# EAGLE design radio_module_V4.0 (EAGLE 7.3.0)
Assembly variants: X4
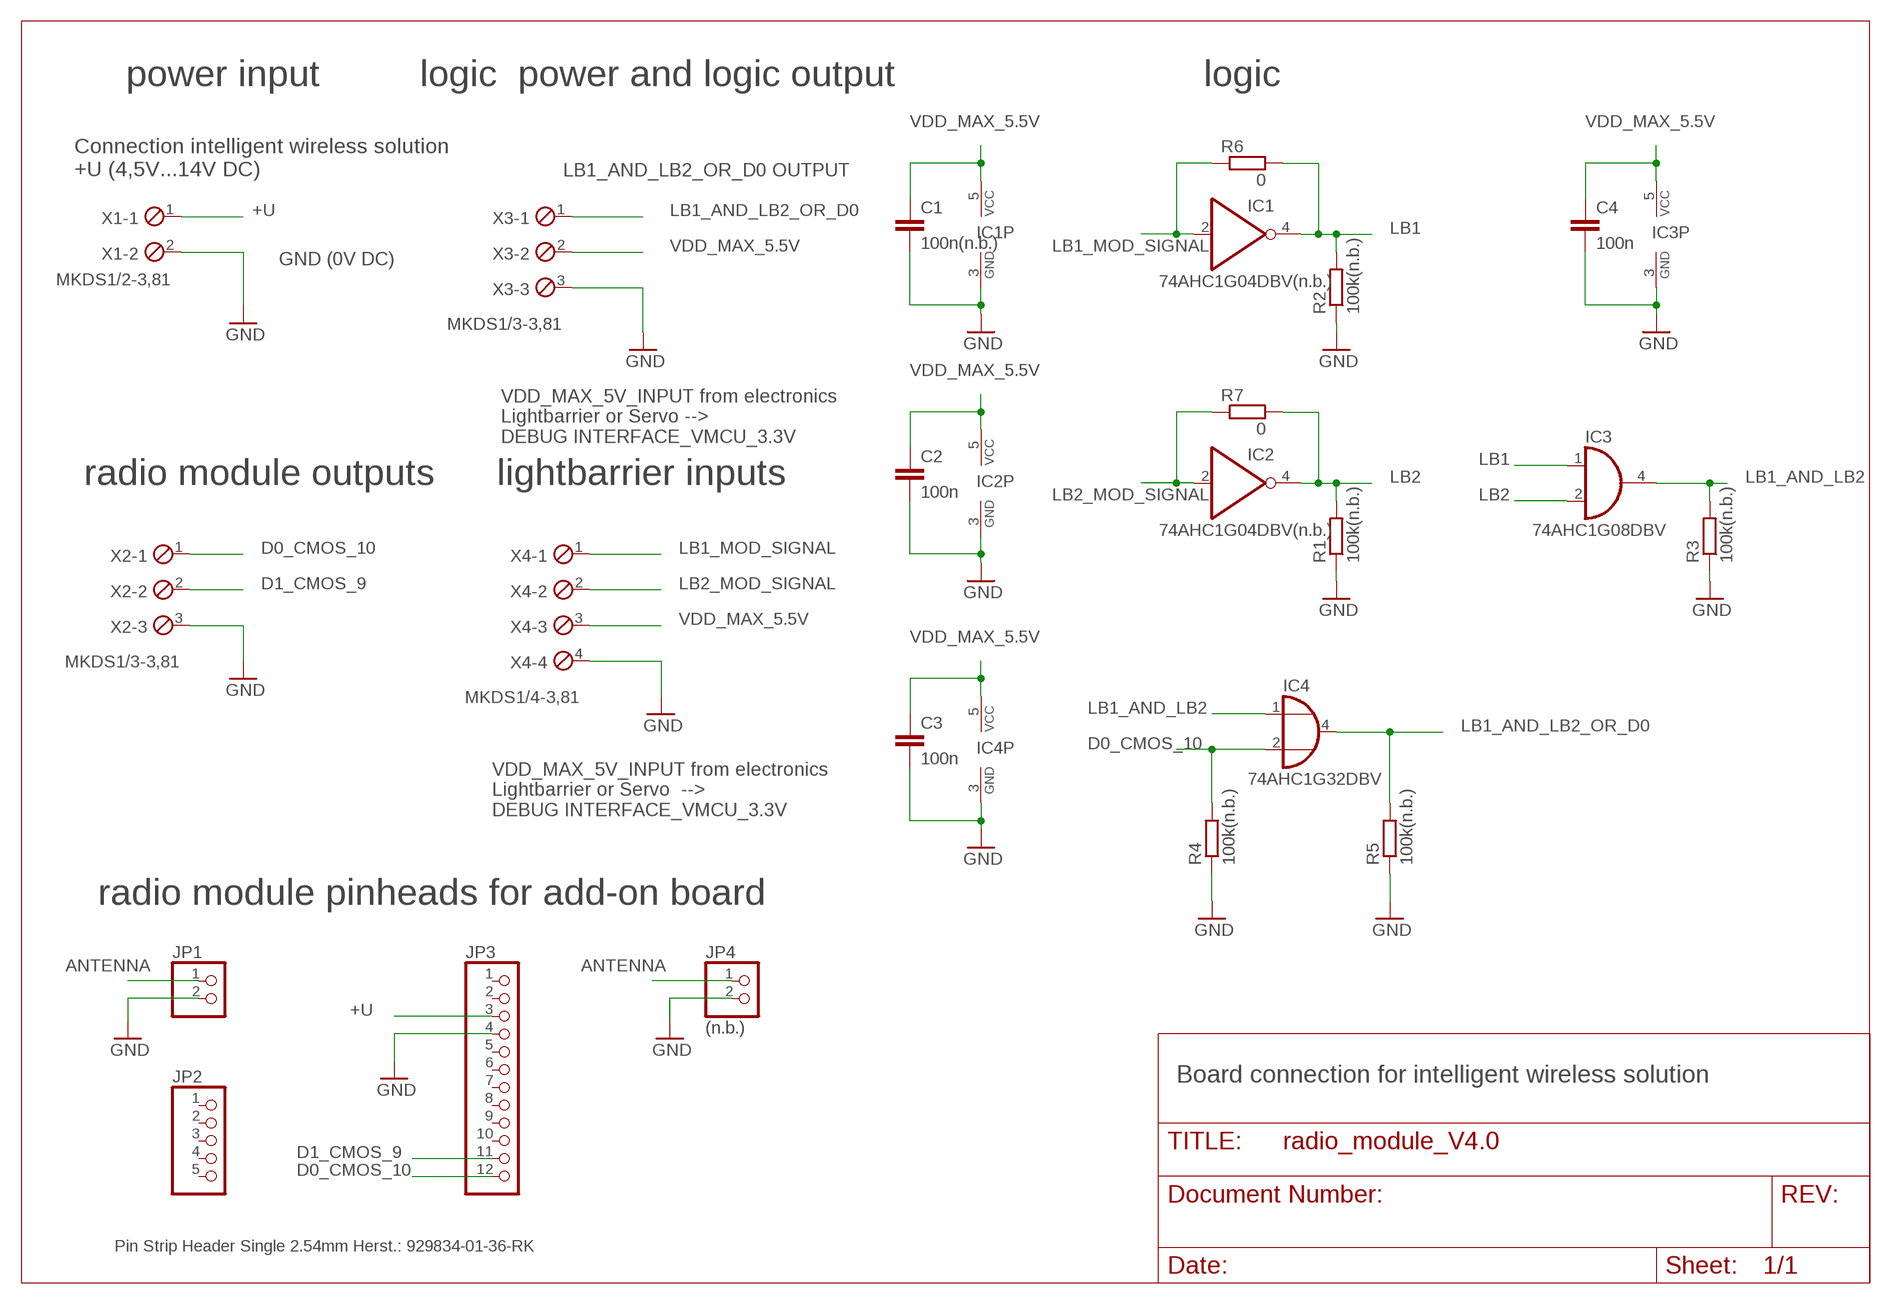
[diagram p0: schematic, sheet 1]

## Parts
C1  100n(n.b.)  C-EUC0805  [C0805]
C2  100n  C-EUC0805  [C0805]
C3  100n  C-EUC0805  [C0805]
C4  100n  C-EUC0805  [C0805]
IC1  74AHC1G04DBV(n.b.)  74AHC1G04DBV  [SOT23-5]
IC2  74AHC1G04DBV(n.b.)  74AHC1G04DBV  [SOT23-5]
IC3  74AHC1G08DBV  [SOT23-5]
IC4  74AHC1G32DBV  [SOT23-5]
JP1  PINHD-1X2  [1X02]
JP2  PINHD-1X5  [1X05]
JP3  PINHD-1X12  [1X12]
JP4  (n.b.)  PINHD-1X2  [1X02]
R1  100k(n.b.)  R-EU_R0805  [R0805]
R2  100k(n.b.)  R-EU_R0805  [R0805]
R3  100k(n.b.)  R-EU_R0805  [R0805]
R4  100k(n.b.)  R-EU_R0805  [R0805]
R5  100k(n.b.)  R-EU_R0805  [R0805]
R6  0  R-EU_R0805  [R0805]
R7  0  R-EU_R0805  [R0805]
X1  MKDS1/2-3,81  [2POL381]
X2  MKDS1/3-3,81  [3POL381]
X3  MKDS1/3-3,81  [3POL381]
X4  MKDS1/4-3,81  [4POL381]

## Nets
+U: JP3.3 X1.1
ANTENNA: JP1.1 JP4.1
D0_CMOS_10: IC4.2(I1) JP3.12 R4.2 X2.1
D1_CMOS_9: JP3.11 X2.2
GND: C1.2 C2.2 C3.2 C4.2 IC1.3(GND) IC2.3(GND) IC3.3(GND) IC4.3(GND) JP1.2 JP3.4 JP4.2 R1.1 R2.1 R3.1 R4.1 R5.1 X1.2 X2.3 X3.3 X4.4
LB1: IC1.4(O) IC3.1(I0) R2.2 R6.2
LB1_AND_LB2: IC3.4(O) IC4.1(I0) R3.2
LB1_AND_LB2_OR_D0: IC4.4(O) R5.2 X3.1
LB1_MOD_SIGNAL: IC1.2(I) R6.1 X4.1
LB2: IC2.4(O) IC3.2(I1) R1.2 R7.2
LB2_MOD_SIGNAL: IC2.2(I) R7.1 X4.2
VDD_MAX_5.5V: C1.1 C2.1 C3.1 C4.1 IC1.5(VCC) IC2.5(VCC) IC3.5(VCC) IC4.5(VCC) X3.2 X4.3
Unconnected: JP2.1 JP2.2 JP2.3 JP2.4 JP2.5 JP3.1 JP3.2 JP3.5 JP3.6 JP3.7 JP3.8 JP3.9 JP3.10

## Notes on the sheet
- power input | logic  power and logic output | logic
- Connection intelligent wireless solution
  +U (4,5V...14V DC)
- LB1_AND_LB2_OR_D0 OUTPUT
- GND (0V DC)
- VDD_MAX_5V_INPUT from electronics
  Lightbarrier or Servo --> 
  DEBUG INTERFACE_VMCU_3.3V
- radio module outputs | lightbarrier inputs
- VDD_MAX_5V_INPUT from electronics
  Lightbarrier or Servo  --> 
  DEBUG INTERFACE_VMCU_3.3V
- radio module pinheads for add-on board
- Board connection for intelligent wireless solution
- Pin Strip Header Single 2.54mm Herst.: 929834-01-36-RK

## Library data of the parts
C1-C4 = rcl:C-EU: CAPACITOR, European symbol
IC1 IC2 = 74xx-little-de:74*1G04: INVERTER Gate
IC3 = 74xx-little-de:74*1G08: 2-input AND gate
IC4 = 74xx-little-de:74*1G32: 2-input OR gate
JP1 JP4 = pinhead:PINHD-1X2: PIN HEADER
JP2 = pinhead:PINHD-1X5: PIN HEADER
JP3 = pinhead:PINHD-1X12: PIN HEADER
R1-R5 = resistor:R-EU_: RESISTOR, European symbol
R6 R7 = rcl:R-EU_: RESISTOR, European symbol
X1 = con-phoenix-381:MKDS1/2-3,81: MKDS 1/2-3,81 - Order No. 1727010 (RS-Online - 101-5384) Pitch: 3,81mm Number of terminals: 2 Rated Voltage: 160V Maximum load current/ cross section: 12A/1.5mm2-AWG16 Housing Interlocking: none Color: Green
X2 X3 = con-phoenix-381:MKDS1/3-3,81: MKDS 1/3-3,81 - Order No. 1727023 (RS-Online - 101-5390) Pitch: 3,81mm Number of terminals: 3 Rated Voltage: 160V Maximum load current/ cross section: 12A/1.5mm2-AWG16 Housing Interlocking: none Color: Green
X4 = con-phoenix-381:MKDS1/4-3,81: MKDS 1/4-3,81 - Order No. 1727036 Pitch: 3,81mm Number of terminals: 4 Rated Voltage: 160V Maximum load current/ cross section: 12A/1.5mm2-AWG16 Housing Interlocking: none Color: Green

## Net classes
0 default: width 0.15 mm
1 GND: width 0.2 mm
2 VCC: width 0.25 mm

## Board
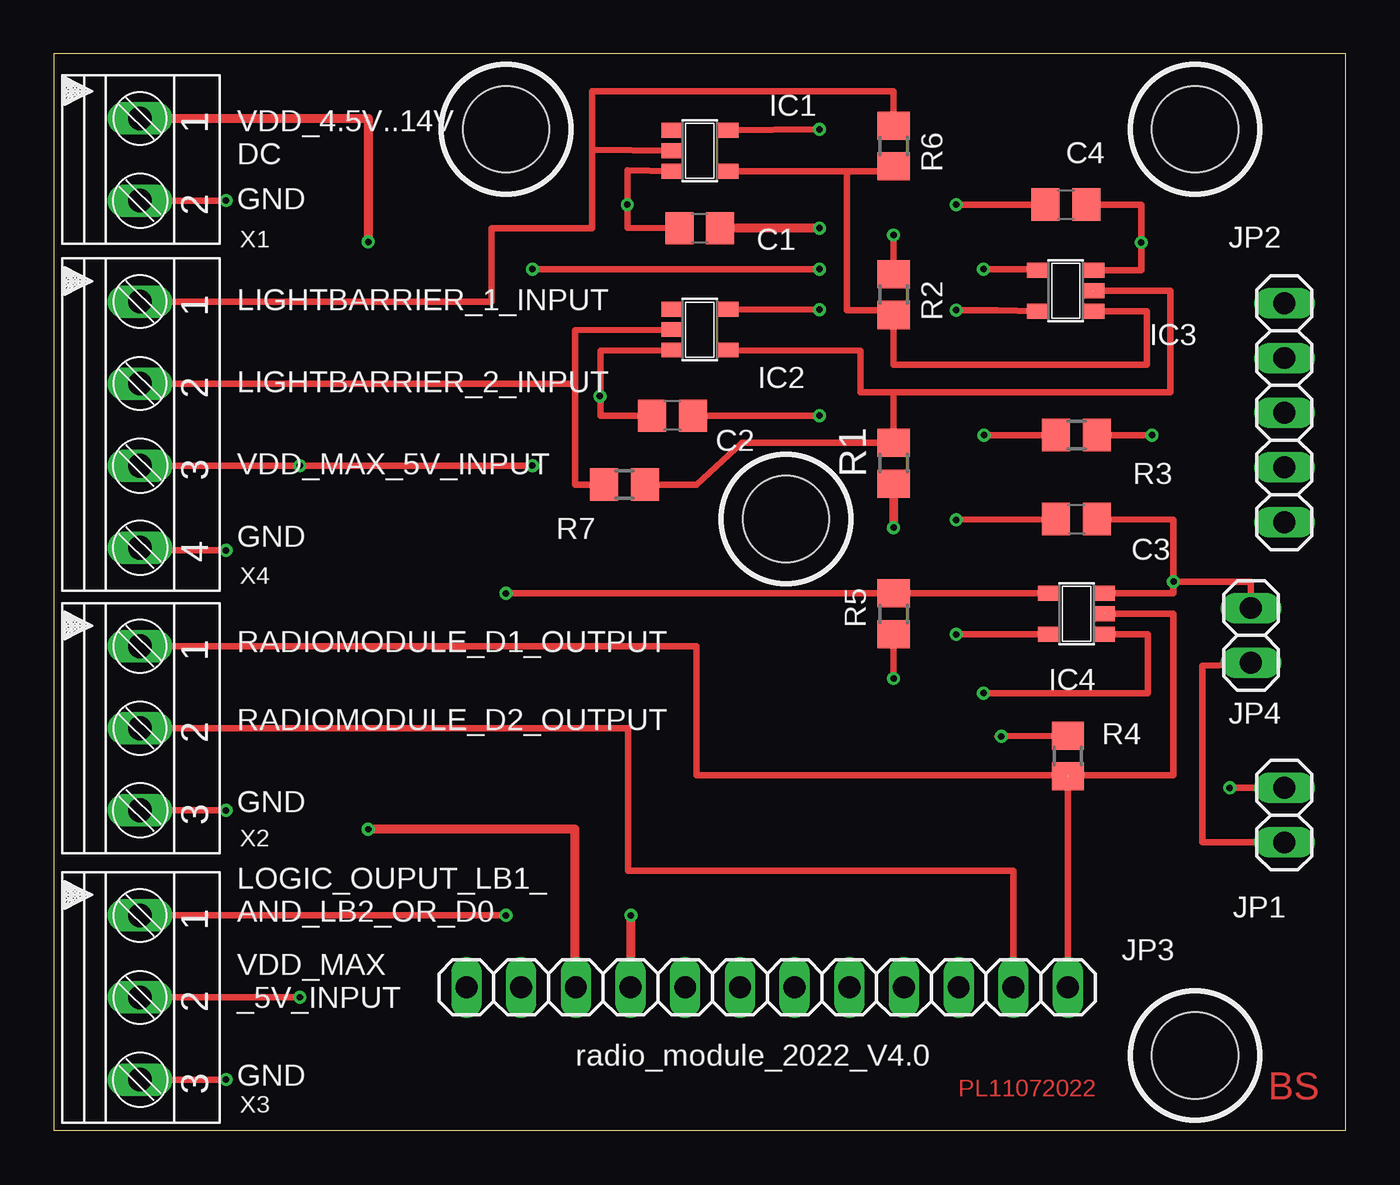
[diagram p1: board, top side]
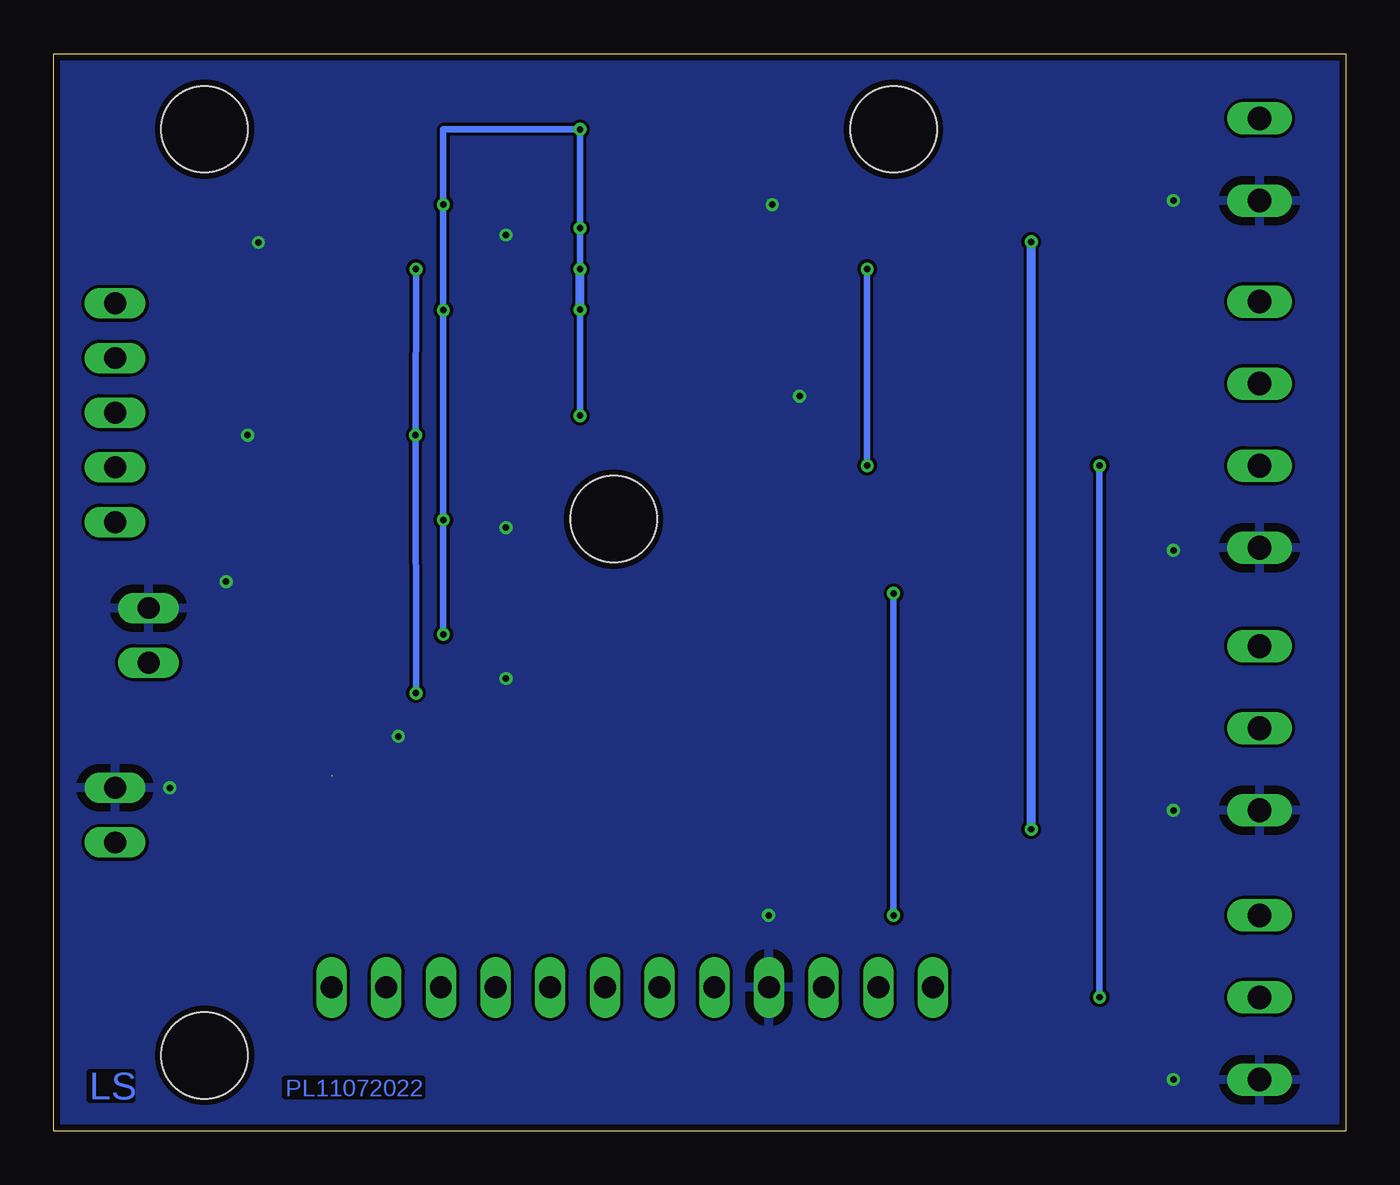
[diagram p2: board, bottom side, seen from below]

Size 60 x 50 mm. Coordinates in mm from the lower left corner, seen from the top.
Outline: 0,50 0,0 60,0 60,50 0,50
Copper layers (1+2*3+16): Top 0.035mm / dielectric 0.2mm / Route2 0.035mm / dielectric 1mm / Route3 0.035mm / dielectric 0.2mm / Bottom 0.035mm
Design rules "default *": minimum track width 0.15mm, minimum drill 0.3mm, track to track 0.15mm, track to pad 0.15mm, pad to pad 0.15mm, via to via 0.15mm, smd to smd 0mil, copper to edge 0.3mm, drill to drill 0.2mm, minimum pad ring 0.2mm, minimum via ring 0.15mm, stop-mask expansion 0.075mm, vias tented up to drill 0mil, thermal gap 0.4mm
Holes 4 mm at 21,46.5 53,3.5 53,46.5 34,28.4
bKeepout: area 0,-5.8 to 45.2,-0.3

### Footprints (pad centres in the part's own frame; a part is rotated, then mirrored left to right if it is on the bottom)
C0805 = smd 1.3 x 1.5: 1 -0.95,0; 2 0.95,0
SOT23-5 = smd 0.69 x 0.99: 1 -0.95,-1.29; 2 0,-1.29; 3 0.95,-1.29; 4 0.95,1.3; 5 -0.95,1.3
1X02 = drill 1.016 long: 1 -1.27,0; 2 1.27,0
1X05 = drill 1.016 long: 1 -5.08,0; 2 -2.54,0; 3 0,0; 4 2.54,0; 5 5.08,0
1X12 = drill 1.016 long: 1 -13.97,0; 2 -11.43,0; 3 -8.89,0; 4 -6.35,0; 5 -3.81,0; 6 -1.27,0; 7 1.27,0; 8 3.81,0; 9 6.35,0; 10 8.89,0; 11 11.43,0; 12 13.97,0
R0805 = smd 1.3 x 1.5: 1 -0.95,0; 2 0.95,0
2POL381 = drill 1.1 long: 1 0,0; 2 3.81,0
3POL381 = drill 1.1 long: 1 0,0; 2 3.81,0; 3 7.62,0
4POL381 = drill 1.1 long: 1 0,0; 2 3.81,0; 3 7.62,0; 4 11.43,0

### Placement (x,y rotation side)
C1  30,41.9 180 top
C2  28.73,33.2 180 top
C3  47.5,28.4 0 top
C4  47,43 0 top
IC1  30,45.5 270 top
IC2  30,37.2 270 top
IC3  47,39 90 top
IC4  47.5,24 90 top
JP1  57.15,14.65 90 top
JP2  57.15,33.34 90 top
JP3  33.13,6.66 0 top
JP4  55.6,23 90 top
R1  39,31 90 top
R2  39,38.83 270 top
R3  47.5,32.3 180 top
R4  47.1,17.4 270 top
R5  39,24 90 top
R6  39,45.72 270 top
R7  26.5,30 0 top
X1  4,47 270 top
X2  4,22.5 270 top
X3  4,10 270 top
X4  4,38.5 270 top

### Tracks (layer width: path | path; a pad name or v marks a point on that pad's centre or on a via)
+U  (via drill 0.3)
  Top 0.406: JP3.3 24.2,6.66 24.2,14 v14.61,14 | X1.1 14.61,47 v14.61,41.27
  Bottom 0.406: v14.61,14 v14.61,41.27
ANTENNA
  Top 0.305: JP1.1 53.34,13.38 53.34,21.59 55,21.64 JP4.1
D0_CMOS_10  (1 unrouted)
  Top 0.305: X2.1 29.84,22.5 29.84,16.5 47.1,16.5 | 47.1,16.5 JP3.12 | IC4.2 52,24 52,16.5 47.1,16.5
D1_CMOS_9
  Top 0.305: X2.2 26.67,18.69 26.67,12.06 44.56,12.06 JP3.11
GND  (via drill 0.3)
  Top 0.305: X3.3 v8,2.38 | X2.3 v8,14.88 | JP1.2 v54.61,15.93 | 4,26.95 v8,26.95 | X1.2 v8,43.19 | IC3.3 50.5,39.95 50.5,41.27 50.5,43 C4.2 | R3.1 v51,32.3 | R5.1 v39,21 | IC4.3 52,24.95 v52,25.5 | 43.83,18.32 v44,18.32 R4.1 | C3.2 52,28.36 v52,25.5 | R2.1 v39,41.59 | IC1.3 26.64,44.59 v26.64,43 26.64,41.92 C1.2 | IC2.3 25.4,36.23 25.4,34.11 | C2.2 25.4,33.2 25.4,34.11 | v25.36,34.11 25.4,34.11 | JP4.2 55.6,25.5 v52,25.5
  Top 0.406: v54.61,15.93 54.61,15.88 | JP3.4 26.8,6.66 v26.8,10 | 50.5,41.27 v50.5,41.24 | R1.1 v39,28
  pour Bottom: 0,50 0,0 60,0 60,50 arc-2
LB1
  Top 0.305: IC1.4 36.83,44.55 | IC3.1 50.77,38.05 50.77,35.56 39,35.56 R2.2 | 36.83,44.55 36.83,38.1 39,38.1 | 36.83,44.55 39,44.55 R6.2
  Top 0.406: 39,38.1 R2.2
LB1_AND_LB2  (via drill 0.3)
  Top 0.305: R3.2 v43.2,32.3 43.18,32.3 | v43.18,40.01 45.7,40.01 IC3.4 | IC4.1 50.8,23.05 50.8,20.32 v43.18,20.32
  Bottom 0.305: v43.18,40.01 v43.2,32.3 v43.18,20.32
LB1_AND_LB2_OR_D0  (via drill 0.3)
  Top 0.305: X3.1 v21,10 | v21,24.95 R5.2 IC4.4
  Bottom 0.305: v21,10 v21,24.95
LB1_MOD_SIGNAL
  Top 0.305: X4.1 20.32,38.5 20.32,41.91 25,41.91 25,45.54 | 25,45.54 IC1.2 | R6.1 39,48.26 25,48.26 25,45.54
LB2
  Top 0.305: IC3.2 51.87,39 51.87,34.29 39,34.29 | 39,34.29 R1.2 31.95,31.95 29.84,30 R7.2 | IC2.4 37.47,36.23 37.47,34.29 39,34.29
LB2_MOD_SIGNAL
  Top 0.305: X4.2 24.2,34.69 | 24.2,34.69 24.2,37.17 IC2.2 | R7.1 24.2,30 24.2,34.69
VDD_MAX_5.5V  (via drill 0.3)
  Top 0.305: X4.3 v11.43,30.88 v22.23,30.88 | v11.43,6.2 X3.2 | IC2.5 v35.56,38.12 | IC1.5 v35.56,46.49 | C2.1 v35.56,33.2 | C3.1 v41.91,28.36 | v41.91,38.1 43.8,38.1 IC3.5 | v41.91,23.05 IC4.5 | v22.23,40.01 v35.56,40.01 | v41.91,43 C4.1
  Top 0.406: X3.2 | v35.56,41.91 32.95,41.91 C1.1
  Bottom 0.305: v11.43,30.88 v11.43,6.2 | v35.56,33.2 v35.56,40.01 v35.56,41.91 v35.56,46.49 41.91,46.49 v41.91,43 v41.91,38.1 v41.91,28.36 v41.91,23.05 | v22.23,30.88 v22.23,40.01
  Bottom 0.406: v35.56,38.12 v35.56,40.01

### Text on the board
Top: PL11072022 | BS
Bottom: PL11072022 | LS
tNames: VDD_4.5V..14V / DC | GND | LIGHTBARRIER_1_INPUT | LIGHTBARRIER_2_INPUT | VDD_MAX_5V_INPUT | GND | RADIOMODULE_D1_OUTPUT | RADIOMODULE_D2_OUTPUT | GND | LOGIC_OUPUT_LB1_ / AND_LB2_OR_D0 | VDD_MAX / _5V_INPUT | radio_module_2022_V4.0 | GND